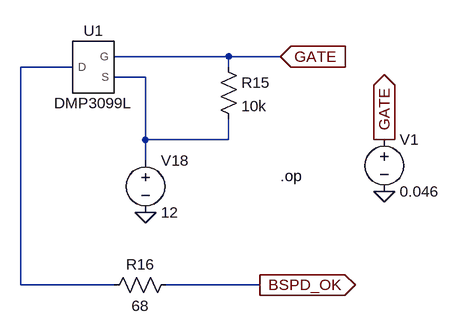
[diagram p0: schematic BSPD_Q1.asc]
BSPD_Q1.asc, the LTspice schematic file:
Version 4
SHEET 1 3164 1616
WIRE 2800 528 2624 528
WIRE 2880 528 2800 528
WIRE 2560 544 2480 544
WIRE 2800 544 2800 528
WIRE 2672 560 2624 560
WIRE 2672 656 2672 560
WIRE 2800 656 2800 624
WIRE 2800 656 2672 656
WIRE 2672 688 2672 656
WIRE 2480 880 2480 544
WIRE 2624 880 2480 880
WIRE 2848 880 2704 880
FLAG 2672 768 0
FLAG 2848 880 BSPD_OK
IOPIN 2848 880 Out
FLAG 2880 528 GATE
IOPIN 2880 528 In
FLAG 3040 736 0
FLAG 3040 656 GATE
IOPIN 3040 656 Out
SYMBOL voltage 2672 672 R0
SYMATTR InstName V18
SYMATTR Value 12
SYMBOL res 2784 528 R0
SYMATTR InstName R15
SYMATTR Value 10k
SYMBOL res 2720 864 R90
WINDOW 0 0 56 VBottom 2
WINDOW 3 32 56 VTop 2
SYMATTR InstName R16
SYMATTR Value 68
SYMBOL voltage 3040 640 R0
SYMATTR InstName V1
SYMATTR Value 0.046
SYMBOL AutoGenerated/DMP3099L 2592 544 R0
SYMATTR InstName U1
TEXT 2880 712 Left 2 !.op

The netlist it stands for:
* BSPD_Q1.asc
V18 N002 0 12
R15 GATE N002 10k
R16 BSPD_OK N001 68
V1 GATE 0 0.046
XU1 N001 GATE N002 DMP3099L  ; pins D G S
.op
.lib /Users/jshao109/Downloads/DMP3099L.spice (2).txt
.backanno
.end